# EAGLE design RotaryEncoder_Breakout_3ch (EAGLE 6.5.0)
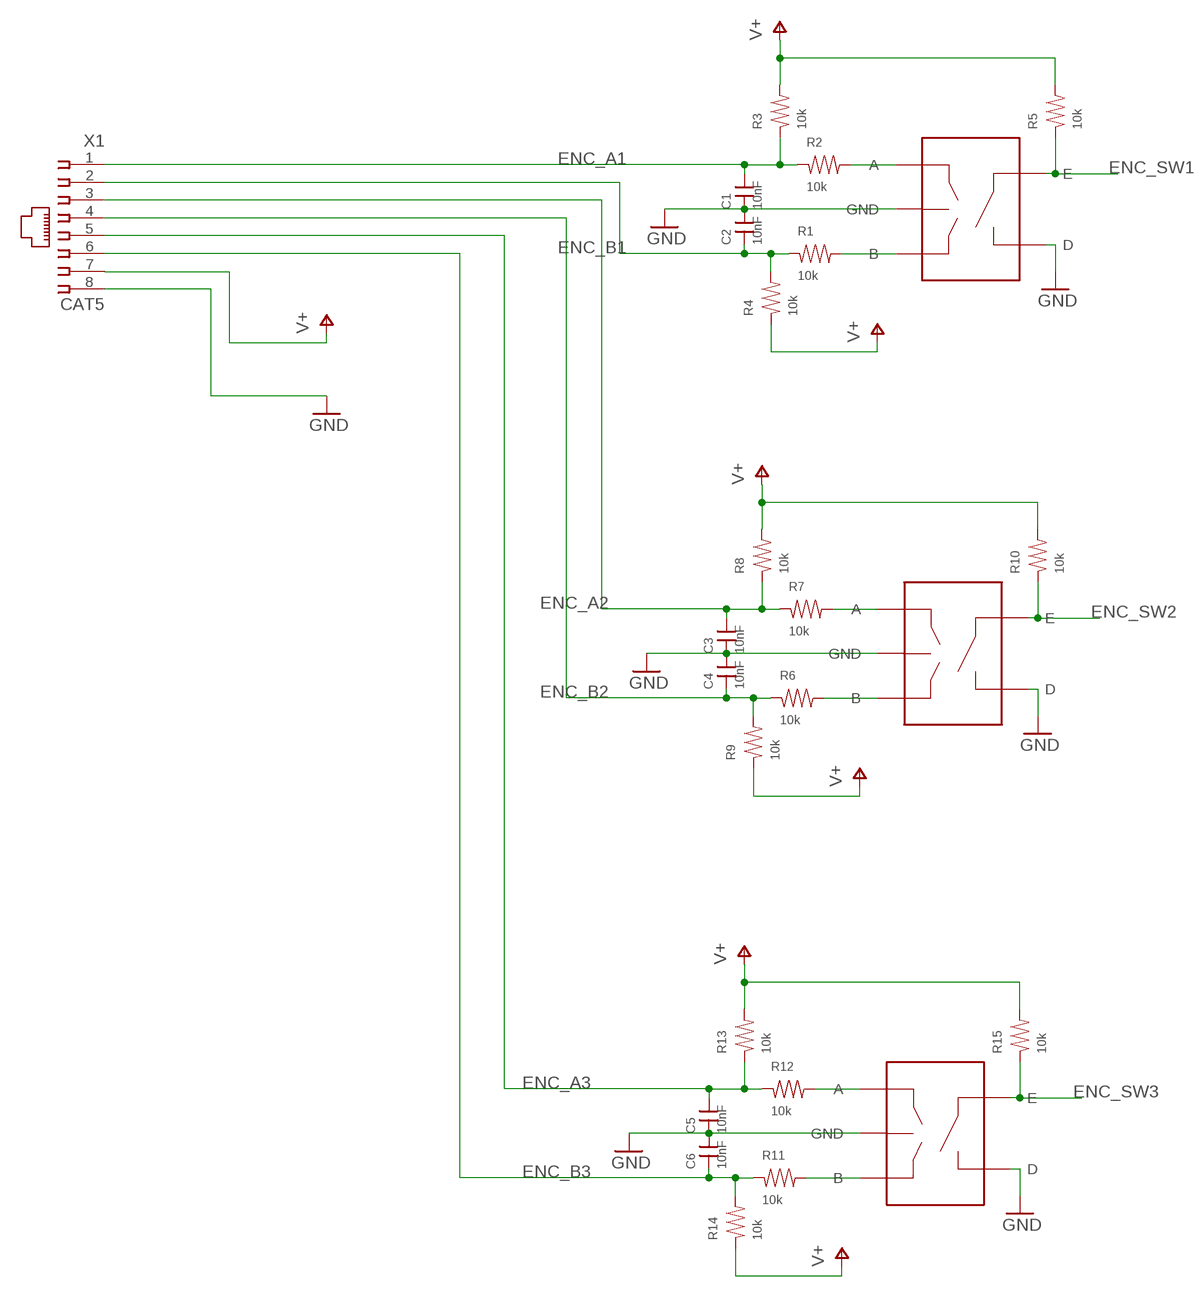
[diagram p0: schematic, sheet 1]

## Parts
C1  10nF  CAP0603  [0603]
C2  10nF  CAP0603  [0603]
C3  10nF  CAP0603  [0603]
C4  10nF  CAP0603  [0603]
C5  10nF  CAP0603  [0603]
C6  10nF  CAP0603  [0603]
ENC1  PEC09  [PEC092320FS]
ENC2  PEC09  [PEC092320FS]
ENC3  PEC09  [PEC092320FS]
R1  10k  RES0603  [0603]
R2  10k  RES0603  [0603]
R3  10k  RES0603  [0603]
R4  10k  RES0603  [0603]
R5  10k  RES0603  [0603]
R6  10k  RES0603  [0603]
R7  10k  RES0603  [0603]
R8  10k  RES0603  [0603]
R9  10k  RES0603  [0603]
R10  10k  RES0603  [0603]
R11  10k  RES0603  [0603]
R12  10k  RES0603  [0603]
R13  10k  RES0603  [0603]
R14  10k  RES0603  [0603]
R15  10k  RES0603  [0603]
X1  CAT5  [555164-1]

## Nets
ENC_A1: C1.2 R2.1 R3.1 X1.1
ENC_A2: C3.2 R7.1 R8.1 X1.3
ENC_A3: C5.2 R12.1 R13.1 X1.5
ENC_B1: C2.1 R1.1 R4.2 X1.2
ENC_B2: C4.1 R6.1 R9.2 X1.4
ENC_B3: C6.1 R11.1 R14.2 X1.6
ENC_SW1: ENC1.E R5.1
ENC_SW2: ENC2.E R10.1
ENC_SW3: ENC3.E R15.1
GND: C1.1 C2.2 C3.1 C4.2 C5.1 C6.2 ENC1.C(GND) ENC1.D ENC2.C(GND) ENC2.D ENC3.C(GND) ENC3.D X1.8
N$1: ENC2.B R6.2
N$2: ENC2.A R7.2
N$3: ENC3.B R11.2
N$4: ENC1.B R1.2
N$5: ENC1.A R2.2
N$6: ENC3.A R12.2
V+: R3.2 R4.1 R5.2 R8.2 R9.1 R10.2 R13.2 R14.1 R15.2 X1.7

## Library data of the parts
C1-C6 = rlc-jqi:CAP: SMT Capacitor
ENC1-ENC3 = connector-jqi:PEC09: PEC09-2320F-S0015 Rotary Encoder (Bourns).
R1-R15 = rlc-jqi:RES: SMT Resistor
X1 = connector-jqi:CAT5: Standard CAT-5 Ethernet jack.; DIGIKEY: A31442-ND

## Board
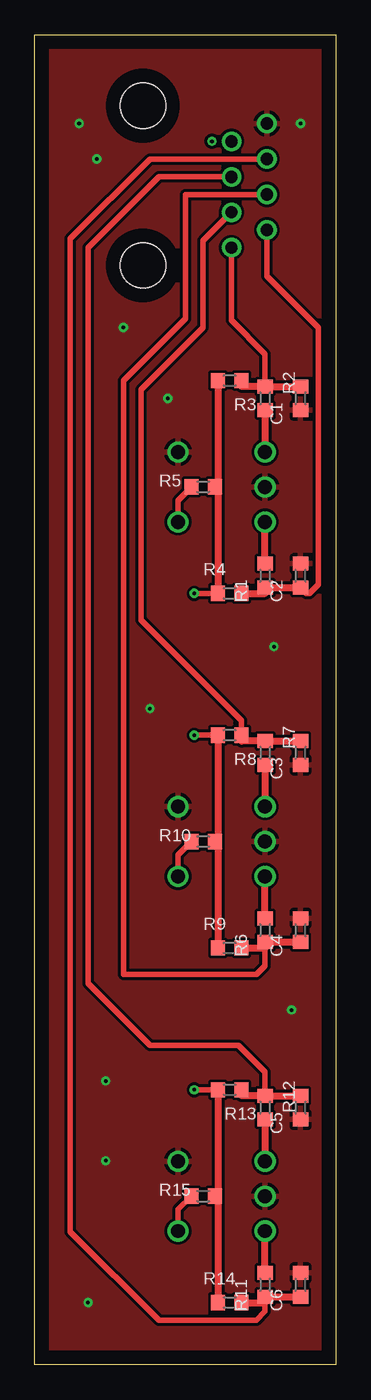
[diagram p1: board, top side]
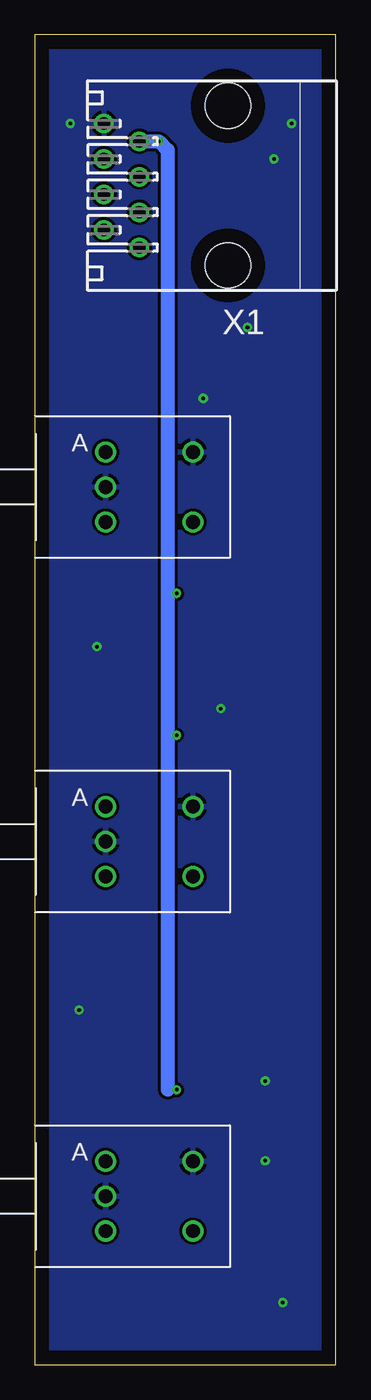
[diagram p2: board, bottom side, seen from below]

Size 21.59 x 95.25 mm. Coordinates in mm from the lower left corner, seen from the top.
Outline: 0,95.25 21.59,95.25 21.59,0 0,0 0,95.25
Copper layers (1*16): Top 0.035mm / dielectric 1.5mm / Bottom 0.035mm
Design rules "default *": minimum track width 10mil, minimum drill 10mil, track to track 8mil, track to pad 8mil, pad to pad 8mil, via to via 8mil, smd to smd 8mil, copper to edge 40mil, drill to drill 8mil, minimum pad ring 10mil, minimum via ring 8mil, stop-mask expansion 4mil, vias tented up to drill 0mil, thermal gap 10mil

### Footprints (pad centres in the part's own frame; a part is rotated, then mirrored left to right if it is on the bottom)
0603 = smd 1 x 1.1: 1 -0.85,0; 2 0.85,0
PEC092320FS = drill 1: A 0,-2.5; B 0,2.5; C 0,0; D -6.25,-2.5; E -6.25,2.5
555164-1 = drill 0.889: 1 -4.445,6.477; 2 -3.175,9.017; 3 -1.905,6.477; 4 -0.635,9.017; 5 0.635,6.477; 6 1.905,9.017; 7 3.175,6.477; 8 4.445,9.017 | hole 3.251: -5.715,0.127; 5.715,0.127

### Placement (x,y rotation side)
C1  19.05,69.22 90 top
C2  19.05,56.52 90 top
C3  19.05,43.81 90 top
C4  19.05,31.12 90 top
C5  19.05,18.41 90 top
C6  19.05,5.71 90 top
ENC1  16.51,62.87 180 bottom
ENC2  16.51,37.47 180 bottom
ENC3  16.51,12.07 180 bottom
R1  16.51,56.52 90 top
R2  16.51,69.22 270 top
R3  13.97,70.48 180 top
R4  13.97,55.25 0 top
R5  12.07,62.87 0 top
R6  16.51,31.12 90 top
R7  16.51,43.81 270 top
R8  13.97,45.09 180 top
R9  13.97,29.84 0 top
R10  12.07,37.47 0 top
R11  16.51,5.71 90 top
R12  16.51,18.41 270 top
R13  13.97,19.69 180 top
R14  13.97,4.45 0 top
R15  12.07,12.07 0 top
X1  7.62,84.45 90 bottom

### Tracks (layer width: path | path; a pad name or v marks a point on that pad's centre or on a via)
ENC_A1
  Top 0.406: X1.1 14.1,74.8 16.51,72.39 R2.1
  Top 0.508: C1.2 R2.1 14.82,70.06 R3.1
ENC_A2
  Top 0.406: X1.3 12.07,80.52 12.07,74.3 7.62,69.85 7.62,53.34 14.82,46.14 R8.1
  Top 0.508: C3.2 R7.1 14.82,44.66 R8.1
ENC_A3
  Top 0.406: X1.5 8.89,85.09 3.81,80.01 3.81,27.3 8.26,22.86 14.61,22.86 16.51,20.96 R12.1
  Top 0.508: C5.2 R12.1 14.82,19.27 R13.1
ENC_B1
  Top 0.406: X1.2 16.64,77.98 20.32,74.3 20.32,55.88 19.69,55.25 19.47,55.25 C2.1
  Top 0.508: R4.2 16.51,55.25 R1.1 C2.1
ENC_B2
  Top 0.406: X1.4 10.8,83.82 10.8,74.93 6.35,70.48 6.35,27.94 15.88,27.94 16.51,28.57 R6.1
  Top 0.508: R9.2 16.51,29.84 R6.1 C4.1
ENC_B3
  Top 0.406: X1.6 8.26,86.36 2.54,80.65 2.54,9.53 8.89,3.18 15.88,3.18 16.51,3.81 R11.1
  Top 0.508: R14.2 16.51,4.45 R11.1 C6.1
ENC_SW1
  Top 0.406: R5.1 10.26,61.91 ENC1.E
ENC_SW2
  Top 0.406: R10.1 10.26,36.51 ENC2.E
ENC_SW3
  Top 0.406: R15.1 10.26,11.11 ENC3.E
GND  (via drill 0.25)
  other vias: 4.45,86.36 3.18,88.9 6.35,74.3 9.53,69.22 17.15,51.44 8.26,46.99 5.08,20.32 18.42,25.4 3.81,4.45 5.08,14.61 19.05,88.9
  pour Bottom: 0,94.61 21.59,94.61 21.59,0.64 0,0.64
  pour Top: 0,94.61 21.59,94.61 21.59,0.64 0,0.64
N$1
  Top 0.508: R6.2 ENC2.B
N$2
  Top 0.508: R7.2 ENC2.A
N$3
  Top 0.508: R11.2 ENC3.B
N$4
  Top 0.508: R1.2 ENC1.B
N$5
  Top 0.508: R2.2 ENC1.A
N$6
  Top 0.508: R12.2 ENC3.A
V+  (via drill 0.25)
  Top 0.406: R4.1 v11.43,55.25 | R8.2 v11.43,45.09 | R13.2 v11.43,19.69
  Top 0.508: R5.2 13.12,62.87 | 13.12,62.87 R4.1 | R3.2 13.12,62.87 | R10.2 13.12,37.47 | 13.12,37.47 R9.1 | R8.2 13.12,37.47 | R15.2 13.12,12.07 | 13.12,12.07 R14.1 | R13.2 13.12,12.07
  Bottom 0.406: v11.43,55.25 12.07,55.25 | v11.43,45.09 12.07,45.09 | v11.43,19.69 12.07,19.69
  Bottom 1.016: X1.7 v12.7,87.63 12.07,87 12.07,55.25 12.07,45.09 12.07,19.69